# Altium schematic sheet TopLevel.SCHDOC
size A4
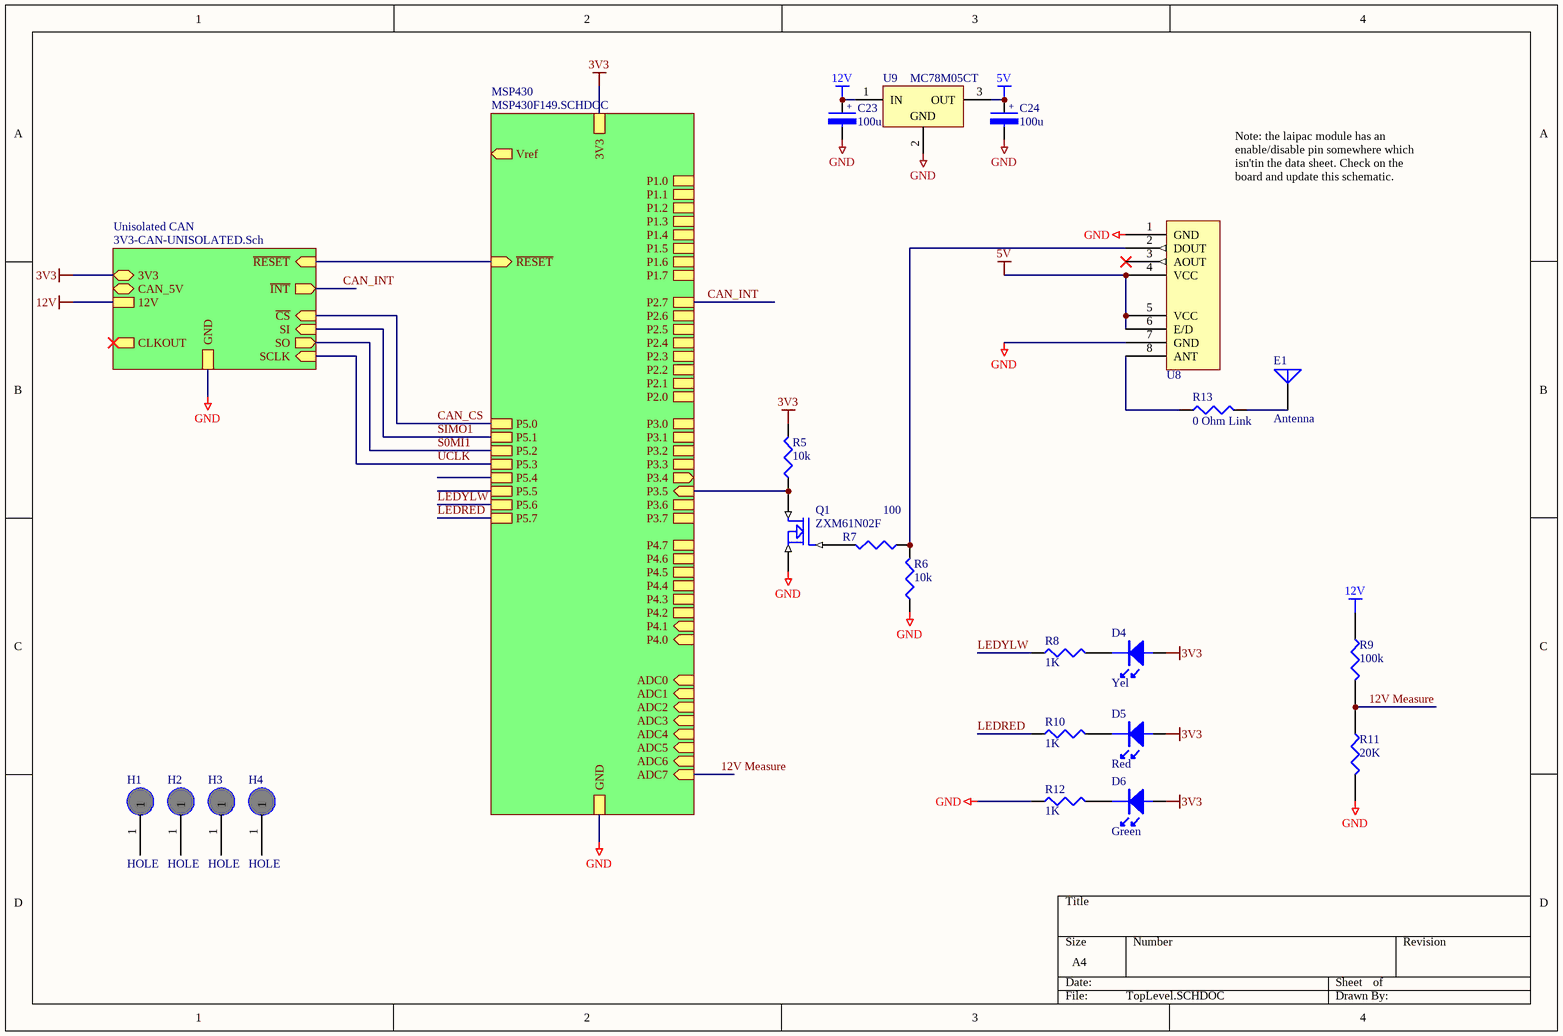
[diagram p0: TopLevel.SCHDOC]

## Parts
C23  100u  [1206]
C24  100u  [1206]
D4  Yel  [LED0.1]
D5  Red  [LED0.1]
D6  Green  [LED0.1]
E1  Antenna  [PIN1]
H1  HOLE  [M2.5]
H2  HOLE  [M2.5]
H3  HOLE  [M2.5]
H4  HOLE  [M2.5]
Q1  ZXM61N02F  [SOT23-3]
R5  10k  [0603]
R6  10k  [0603]
R7  100  [0603]
R8  1K  [0603]
R9  100k  [1206]
R10  1K  [0603]
R11  20K  [1206]
R12  1K  [0603]
R13  0 Ohm Link  [0603]
U8  RLPA  (value not drawn)
U9  MC78M05CT  [221A-04]

## Sub-sheets
MSP430 = MSP430F149.SCHDOC: GND, 3V3, ADC0 (in), ADC1 (in), ADC2 (in), ADC3 (in), ADC4 (in), ADC5 (in), ADC6 (in), ADC7 (in), P1.0, P1.1, P1.2, P1.3, P1.4, P1.5, P1.6, P1.7, P2.0, P2.1, P2.2, P2.3, P2.4, P2.5, P2.6, P2.7, P3.0, P3.1, P3.2, P3.3, P3.4 (out), Vref (out), ~{RESET} (in), P3.5 (in), P3.6, P3.7, P4.0 (in), P4.1 (in), P4.2, P4.3, P4.4, P4.5, P4.6, P4.7, P5.0, P5.1, P5.2, P5.3, P5.4, P5.5, P5.6, P5.7
Unisolated CAN = 3V3-CAN-UNISOLATED.Sch: SI (in), SO (out), ~{CS} (in), SCLK (in), ~{INT} (out), ~{RESET} (in), 12V, GND, 3V3 (bidir), CLKOUT (out), CAN_5V (bidir)

## Nets
3V3: D4.A D5.A D6.A R5.2 ; sheet Unisolated CAN/3V3, sheet MSP430/3V3
5V: C24.1 U8.4(VCC) U8.5(VCC) U8.6(E/D) U9.3(OUT)
12V: C23.1 R9.1 U9.1(IN) ; sheet Unisolated CAN/12V
GND: C23.2 C24.2 Q1.2(S) R6.1 R11.2 R12.1 U8.1(GND) U8.7(GND) U9.2(GND) ; sheet Unisolated CAN/GND, sheet MSP430/GND
12V Measure: R9.2 R11.1 ; sheet MSP430/ADC7
CAN_CS: sheet Unisolated CAN/~{CS}, sheet MSP430/P5.0
CAN_INT: sheet Unisolated CAN/~{INT}, sheet MSP430/P2.7
LEDRED: R10.1 ; sheet MSP430/P5.7
LEDYLW: R8.1 ; sheet MSP430/P5.6
S0MI1: sheet Unisolated CAN/SO, sheet MSP430/P5.2
SIMO1: sheet Unisolated CAN/SI, sheet MSP430/P5.1
UCLK: sheet Unisolated CAN/SCLK, sheet MSP430/P5.3
NetD4_K: D4.K R8.2
NetD5_K: D5.K R10.2
NetD6_K: D6.K R12.2
NetE1_1: E1.1(A) R13.2
NetQ1_1: Q1.1(G) R7.2
NetQ1_3: Q1.3(D) R5.1 ; sheet MSP430/P3.5
NetR6_2: R6.2 R7.1 U8.2(DOUT)
NetR13_1: R13.1 U8.8(ANT)
(unnamed): sheet Unisolated CAN/~{RESET}, sheet MSP430/~{RESET}

Not connected (* = marked no-connect by the designer): H1 1; H2 1; H3 1; H4 1; U8 3(AOUT)*

## Notes on the sheet
- Note: the laipac module has an enable/disable pin somewhere which isn'tin the data sheet. Check on the board and update this schematic.
- (in symbol CAP-POL) +

## Library data of the parts
C23 C24 = CAP-POL: Capacitor
D4-D6 = LED: Farnell: *
E1 = Antenna: Generic Antenna; Published: 24-Mar-1999; Revision: July-2002: Re-released for DXP Platform.; Publisher: Altium Limited
Q1 = ZXM61N02F: 1.7A, 20V N-Channel Enhancement mode FET
R5-R8 R10 R12 R13 = RES1: Resistor; Farnell: *
R9 R11 = RES1: Price: 1.010
  R9: Farnell: 308-6422
  R11: Farnell: 308-6252
U9 = MC78M05CT: 3-Terminal Medium-Current Positive Fixed Voltage Regulator; Note: Pin 2 is electrically connected to TAB; Code - JEDEC: TO-262-AA; Published: 17-Jul-2002; Datasheet: Linear and Interface Integrated Circuits, DL128 Rev2 (1988); Package Reference: 221A-04; Publisher: Altium Limited